# Altium schematic sheet Porsche Brake Light.SchDoc
size A4; SheetNumber: 1; SheetTotal: 1
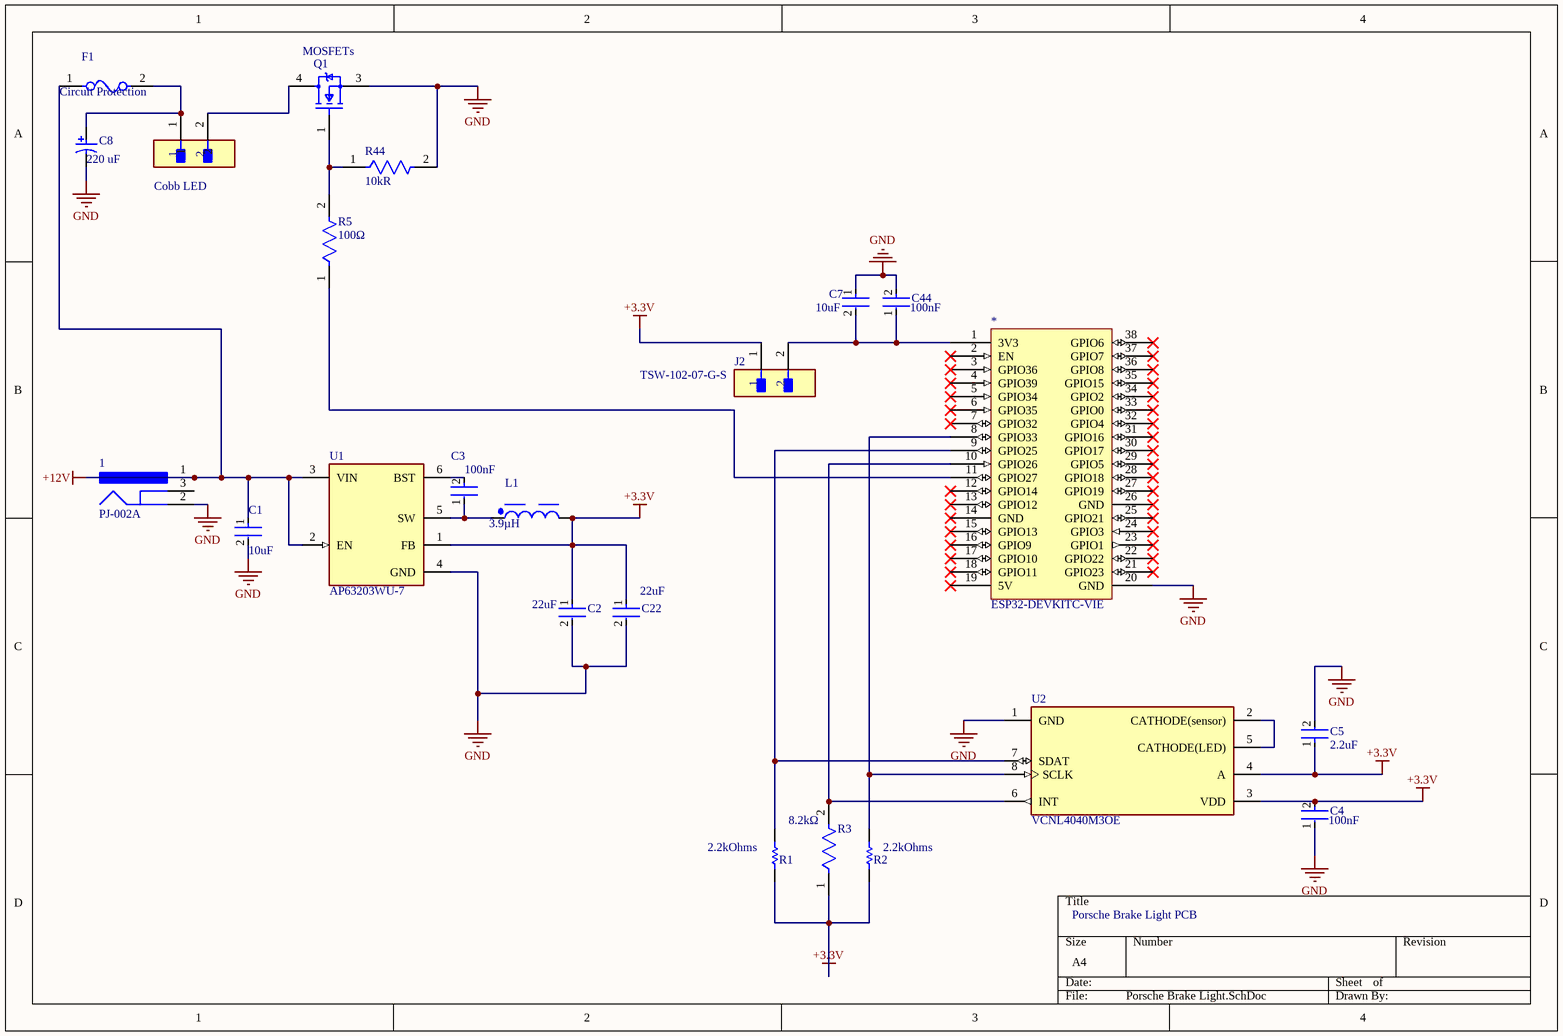
[diagram p0: Porsche Brake Light.SchDoc]

## Parts
1  PJ-002A  [CUI-PJ-002A_V]
*  ESP32-DEVKITC-VIE  [ESP32-DEVKITC-VIE-Footprint-1]
C1  Capacitance: 10uF  [FP-GRM21B-0_15-IPC_C]  (hidden comment: GRM21BR61E106KA73L)
C2  GRM21BZ71A226ME15L  [FP-GRM21B-0_2-e0_2_0_7-IPC_B]  (value not drawn)
C3  Capacitance: 100nF  [FP-C1608-080-0_1-IPC_B]  (hidden comment: C1608X7R1E104K080AA)
C4  Capacitance: 100nF  [FP-C1608-080-0_1-IPC_B]  (hidden comment: C1608X7R1E104K080AA)
C5  Capacitance: 2.2uF  [FP-GRM188-0_1-e0_2_0_5-MFG]  (hidden comment: GRM188R71A225KE15D)
C7  Capacitance: 10uF  [FP-GRM21B-0_15-IPC_C]  (hidden comment: GRM21BR61E106KA73L)
C8  EEE-FK1E221P  [PNSC-EEE-FK1E221P_N]  (value not drawn)
C22  GRM21BZ71A226ME15L  [FP-GRM21B-0_2-e0_2_0_7-IPC_B]  (value not drawn)
C44  Capacitance: 100nF  [FP-C1608-080-0_1-IPC_B]  (hidden comment: C1608X7R1E104K080AA)
Cobb_LED  TSW-102-14-G-S  [FP-TSW-102-14-G-S-MFG]  (value not drawn)
F1  Device Class L1: Circuit Protection  [FP-3216FF-MFG]  (hidden comment: TR/3216FF2-R)
J2  TSW-102-07-G-S  [FP-TSW-102-07-G-S-MFG]
L1  Inductance: 3.9µH  [WE-LQS_5020]  (hidden comment: 74404052039)
Q1  Device Class L3: MOSFETs  [FP-PG-TO252-3-MFG]  (hidden comment: IRLR7843TRPBF)
R1  Resistance: 2.2kOhms  [RESC1608X55X25LL10T15]  (hidden comment: RC0603FR-072K2L)
R2  Resistance: 2.2kOhms  [RESC1608X55X25LL10T15]  (hidden comment: RC0603FR-072K2L)
R3  Resistance: 8.2kΩ  [FP-RC0603-0_55-MFG]  (hidden comment: RC0603FR-078K2L)
R5  Resistance: 100Ω  [FP-RC0603-0_55-MFG]  (hidden comment: RC0603FR-07100RL)
R44  Resistance: 10kR  [FP-RC0603-0_55-IPC_C]  (hidden comment: RC0603FR-0710KL)
U1  AP63203WU-7  [FP-TSOT26-MFG]
U2  VCNL4040M3OE  [FP-VCNL4040M3OE-MFG]

## Nets
+3.3V: C2.1 C4.2 C5.1 C22.1 J2.1 L1.2 R1.1 R2.1 R3.1 U1.1(FB) U2.3(VDD) U2.4(A)
+12V: 1.1 C1.1 F1.1 U1.2(EN) U1.3(VIN)
GND: 1.2 *.20(GND) C1.2 C2.2 C4.1 C5.2 C7.1 C8.2 C22.2 C44.2 Q1.3(SOURCE) R44.2 U1.4(GND) U2.1(GND)
Net*_1: *.1(3V3) C7.2 C44.1 J2.2
Net*_8: *.8(GPIO33) R2.2 U2.8(SCLK)
Net*_9: *.9(GPIO25) R1.2 U2.7(SDAT)
Net*_10: *.10(GPIO26) R3.2 U2.6(INT)
Net*_11: *.11(GPIO27) R5.1
NetC3_1: C3.1 L1.1 U1.5(SW)
NetC3_2: C3.2 U1.6(BST)
NetC8_1: C8.1 Cobb_LED.1 F1.2
NetCobb_LED_2: Cobb_LED.2 Q1.4(DRAIN)
NetQ1_1: Q1.1(GATE) R5.2 R44.1
NetU2_2: U2.2(CATHODE(sensor)) U2.5(CATHODE(LED))

Not connected (* = marked no-connect by the designer): 1 3; * 2(EN)* 3(GPIO36)* 4(GPIO39)* 5(GPIO34)* 6(GPIO35)* 7(GPIO32)* 12(GPIO14)* 13(GPIO12)* 14(GND)* 15(GPIO13)* 16(GPIO9)* 17(GPIO10)* 18(GPIO11)* 19(5V)* 21(GPIO23)* 22(GPIO22)* 23(GPIO1)* 24(GPIO3)* 25(GPIO21)* 26(GND)* 27(GPIO19)* 28(GPIO18)* 29(GPIO5)* 30(GPIO17)* 31(GPIO16)* 32(GPIO4)* 33(GPIO0)* 34(GPIO2)* 35(GPIO15)* 36(GPIO8)* 37(GPIO7)* 38(GPIO6)*

## Notes on the sheet
- (near C8) 220 uF
- (near C2) 22uF
- (near C22) 22uF
- Porsche Brake Light PCB

## Library data of the parts
1 = CMP-2000-06895-2: Through Hole Right Angle DC Power Jack, 2.5 A, 2 mm Center Pin, 3 Position, -25 to 85 degC, RoHS, Bulk; Manufacturer: CUIInc.; Brand: CUI; Inside Contact Diameter: 2mm; Voltage Rating: 24V; Outside Contact Diameter: 6.5mm; Current Rating: 2.5A; Insulation Resistance: 50MOhms; Contact Gender: Male; Connector Type: DCPowerJack; Datasheet Version: Rev. 1.03, 04/2016; Housing Material: PolybutyleneTerephthalate(PBT); Operating Temperature Range: -25Cto+85C; Termination Style: ThroughHole; Product Category: DCPowerConnectors; Mounting Technology: ThroughHole; Mounting Style: ThroughHole; Factory Pack Quantity: 500; Contact Plating: Nickel; Package Reference: PJ-002A; Mounting Angle: Right; Package Description: 3-Pin Through Hole Device, Body 14.4 x 9 mm, Height 11 mm; Flammability Rating: UL94V-0; Manufacturer URL: http://www.cui.com/; Product: Jacks; Contact Material: Copper; Datasheet URL: http://www.cui.com/product/resource/pj-002a.pdf; RoHS: True
* = CMP-00025-00003-3: ESP32-WROVER-IE Series Evaluation Board 802.11 b/g/n (WiFi, WLAN) Bluetooth Smart Ready 4.x Dual Mode
C1 C7 = CMP-2007-03541-2: Chip Multilayer Ceramic Capacitors for General Purpose, 0805, 10uF, X5R, 15%, 10%, 25V; Length: 2mm; Depth: 1.25mm; Termination: SMD/SMT; Voltage: 25V; Height: 1.25mm; Material: Ceramic; Thickness: 0.053inch; Radiation Hardening: No; Min Operating Temperature: -55°C; Width: 0.049inch; Package Quantity: 1; Mount: Surface Mount; Dielectric: X5R; Packaging: Tape and Reel; Voltage Rating (DC): 25V; Lead Free: Lead Free; Max Operating Temperature: 85°C; Case Code (Imperial): 0805; Case/Package: 0805; Tolerance: 10%; Voltage Rating: 25V; Case Code (Metric): 2012
C2 C22 = CMP-06035-023072-1: Chip Multilayer Ceramic Capacitors for General Purpose, 0805, 22uF, X7R, 15%, 20%, 10V
C3 C4 C44 = CMP-2000-05395-2: Multilayer Ceramic Capacitors 100nF ±10% 25V X7R SMD 0603; Lead Free: Lead Free; REACH SVHC: No SVHC; Tolerance: 10%; Case Code (Metric): 1608; Packaging: Tape and Reel; Radiation Hardening: No; Dielectric: X7R; Height: 0.8mm; Width: 0.031inch; Voltage Rating (DC): 25V; Case Code (Imperial): 0603; Mount: Surface Mount; RoHS Compliant: Yes; Depth: 0.8mm; Min Operating Temperature: -55°C; Number of Pins: 2; Weight: 7.1E-05oz; Max Operating Temperature: 125°C; Dielectric Material: Ceramic; Resistor Type: Ceramic; Construction: Flat; Thickness: 0.037inch; Package Quantity: 1; Voltage Rating: 25V; Series: C; Voltage: 25V; Case/Package: 0603; Termination: SMD/SMT; Length: 1.6mm
C5 = CMP-2006-02836-2: Chip Multilayer Ceramic Capacitors for General Purpose, 0603, 2.2uF, X7R, 15%, 10%, 10V; Case Code (Metric): 1608; Height: 0.8mm; Packaging: Cut Tape; Voltage: 10V; Lead Free: Lead Free; Min Operating Temperature: -55°C; Voltage Rating (DC): 10V; Max Operating Temperature: 125°C; Voltage Rating: 10V; Dielectric: X7R; Depth: 0.8mm; Case Code (Imperial): 0603; Termination: SMD/SMT; Case/Package: 0603; Number of Pins: 2; REACH SVHC: No SVHC; Mount: Surface Mount; Width: 0.031inch; Material: Ceramic; Package Quantity: 1; Weight: 7.1E-05oz; Length: 1.6mm; Thickness: 0.035inch; Tolerance: 10%
C8 = CMP-1665-00017-3: Aluminum Electrolytic Capacitor, 220 uF, +/- 20%, 25 V, -55 to 105 degC, 2-Pin CAPAE, RoHS, Tape and Reel; Manufacturer: Panasonic; Voltage Rating: 25 V; ComponentLink2URL: http://industrial.panasonic.com/cdbs/www-data/pdf/RDE0000/ABA0000C1181.pdf; Height: 10.2 mm; Max Operating Temperature: 105 degC; PackageReference: EEE-FK1E221P; ComponentLink1Description: Manufacturer URL; ComponentLink1URL: http://www.panasonic.com/; Mount: Surface Mount; REACH SVHC: No SVHC; Min Operating Temperature: -55 degC; ComponentLink2Description: Datasheet; DatasheetVersion: 03/2016; Length: 10.2 mm; RoHSCompliant: true; Packaging: Tape and Reel; Package Quantity: 500; Lead Pitch: 3.1 mm; Pins: 2; PackageDescription: 2-Pin Electrolytic Aluminum Capacitor, Body 8.3 x 8.3 mm; Mounting Technology: Surface Mount
Cobb_LED = CMP-02766-001740-1: CONN HEADER VERT 2POS 2.54MM; Number of Positions: 2; Max Current Rating: 7.6A; Gender: Male; Max Voltage Rating (AC): 550V; Contact Mating Length: 0.32inch; REACH SVHC: No SVHC; Width: 2.54mm; Insulation Material: PBT; Contact Shape: Square; Contact Plating: Gold; Min Operating Temperature: -55°C; Contact Material: Bronze; Color: Black; Number of Contacts: 2; Housing Material: Polyester; Orientation: Straight; Flammability Rating: UL94 V-0; Max Operating Temperature: 125°C; Contact Type: Male Pin; Radiation Hardening: No; Termination: Solder; RoHS Compliant: Yes; Lead Free: Lead Free; Fastening Type: Pull; Pitch: 2.54mm; Number of Rows: 1; Series: TSW; Insulation Color: Black; Package Quantity: 1; Connector Type: Header; Length: 5.08mm; Contact Finish - Mating: GOLD; Mount: Through Hole; Housing Color: Black; Depth: 2.54mm; Packaging: Bulk
F1 = CMP-31519-000001-1: FUSE BRD MNT 2A 32VAC 63VDC 1206; Manufacturer: Cooper Bussmann; Automotive Grade: Grade 1; Max Fuse Dc Voltage: 63V; Max Fuse Ac Voltage: 32V; Value: 0.066Ω; Fuse Interrupt Dc Current: 50A; Fuse Blow Speed: Fast; Fuse I2T: 0.126A2Sec; Height: 1.09mm; Manufacturer Part Number: TR/3216FF2-R; Temperature Range High: +125°C; Package: 3216FF; Automotive: Yes; Mouser Description: Surface Mount Fuses 32VAC/DC 2A Fast Acting Chip Fuse; Device Class L3: unset; Lead Free: Yes; ComponentLink2URL: https://www.eaton.com/content/dam/eaton/products/electronic-components/resources/data-sheet/eaton-3216ff-surface-mount-fuse-data-sheet.pdf; Temperature Range Low: -55°C; Resistance: 0.066Ω; Device Class L2: Fuses; Temperature: -55°C to +125°C; Category: Fuse; Fuse Current: 2A; RoHS: TRUE; Octopart: https://octopart.com/tr%2F3216ff2-r-cooper+bussmann-8723903; Digikey Description: FUSE BRD MNT 2A 32VAC 63VDC 1206; Fuse Interrupt Ac Current: 50A; Ipc Land Pattern Name: CAPC320160X89; ComponentLink2Description: Datasheet
J2 = CMP-02766-000084-1: CONN HEADER VERT 2POS 2.54MM; Manufacturer: Samtec; Number Of Contacts: 2; Voltage Rating: 550V; Conn Orientation: Straight; Current Rating: 6.3A; Conn Gender: Male; Package: TSW-102-07-G-S; Digikey Description: CONN HEADER VERT 2POS 2.54MM; ComponentLink2URL: http://suddendocs.samtec.com/catalog_english/tsw_th.pdf; Height: 8.71mm; Temperature: -55°C to +125°C; Device Class L2: Headers and Wire Housings; ComponentLink2Description: Datasheet; Device Class L3: unset; Contact Material: Gold,Nickel; Temperature Range Low: -55°C; Temperature Range High: +125°C; RoHS: TRUE; Device Class L1: Connectors; Mouser Description: Conn Unshrouded Header HDR 2 POS 2.54mm Solder ST Thru-Hole Automotive Bulk; Number Of Rows: 1; Category: Conn; Pitch: 2.54mm; Lead Free: Yes; Automotive: No; Manufacturer Part Number: TSW-102-07-G-S; Footprint Url: http://suddendocs.samtec.com/prints/tsw-xxx-xx-x-x-xx-xxx-footprint.pdf; Octopart: https://octopart.com/tsw-102-07-g-s-samtec-272197
L1 = CMP-03913-61645215-2: Power Inductor, Aec-Q200, 3.9Uh, 2.4A Rohs Compliant: Yes; Self Resonant Frequency: 62MHz; Test Frequency: 100kHz; Shielding: Shielded; Tolerance: 30%; Saturation Current: 2.8A; DC Resistance (DCR): 50.5mΩ; Mount: Surface Mount; Case/Package: Nonstandard; Packaging: Tape & Reel (TR); Height: 2mm; Max Operating Temperature: 125°C; Length: 5mm; Ambient Temperature Range Low: -40°C; Height - Seated (Max): 2.0066mm; Current Rating: 2.4A; Composition: Wirewound; Width: 5mm; RoHS: Compliant; Min Operating Temperature: -40°C; Ambient Temperature Range High: 85°C
Q1 = CMP-32901-000143-1: MOSFET N-CH 30V 161A DPAK; Manufacturer: Infineon; Drain To Source Resistance: 3.2mΩ; Depletion Mode: False; Reverse Recovery Time: 39ns; Reverse Recovery Charge: 36nC; Threshold Vgs Max: 2.3V; Rthja Max: 50°C/W; Threshold Vgs Min: 1.4V; Power Dissipation: 140W; Pulse Drain Current: 620A; Input Capacitace At Vds: 4380pF @ 15V; Turn On Delay Time: 25ns; Gate To Source Voltage: 20V; Max Forward Diode Voltage: 1V; Gate Charge At Vgs: 34nC @ 4.5V; Max Junction Temp: +175°C; Number Of Channels: 1; Turn Off Delay Time: 34ns; ComponentLink2URL: https://www.infineon.com/dgdl/irlr7843pbf.pdf?fileId=5546d462533600a40153566de53526d8; Temperature Range High: +175°C; Octopart: https://octopart.com/irlr7843trpbf-infineon-65875062; Temperature: -55°C to +175°C; Manufacturer Part Number: IRLR7843TRPBF; Category: Trans; Package: PG-TO252-3; Footprint Url: https://www.infineon.com/cms/en/product/packages/PG-TO252/PG-TO252-3-901/; Continuous Drain Current: 161A; Digikey Description: MOSFET N-CH 30V 161A DPAK; Automotive: No; Lead Free: Yes; Drain To Source Breakdown Voltage: 30V; Height: 2.52mm; Temperature Range Low: -55°C; RoHS: TRUE; Number Of N Channels: 1; Drain To Source Voltage: 30V; ComponentLink2Description: Datasheet; Device Class L2: Transistors; Device Class L1: Discrete Semiconductors
R1 R2 = CMP-2000-06934-1: Thick Film Resistor, 2.2 KOhm, 100 mW, 50 V, +/- 1%, -55 to 155 degC, 2-Pin SMD (0603), RoHS, Tape and Reel; Manufacturer: Yageo; Temperature Coefficient: 100PPM/C; Voltage Rating: 50V; Power Rating: 100mW; Tolerance: 1%; Datasheet Version: Rev. 7, 05/2017; Case Code - mm: 1608; Series: RC; Mounting Technology: SurfaceMount; Package Description: 2-Pin Surface Mount Device, Body 1.6 x 0.8 mm; Case Code - in: 0603; Package Reference: 0603; Product: ThickFilmResistorsGeneralPurpose; Manufacturer URL: http://www.yageo.com/; Termination Style: SMD/SMT; Operating Temperature Range: -55Cto+155C; Datasheet URL: http://www.yageo.com/documents/recent/PYu-RC_Group_51_RoHS_L_7.pdf; Packaging: Reel
R3 = CMP-1659-00040-2: NexarPartId: 40301092; Voltage Rating (AC): 50V; Power Rating: 100mW; Temperature Coefficient: 100ppm/°C; Tolerance: 1%; Number of Terminations: 2; Length: 1.6mm; Height: 450µm; Composition: Thick Film; Case Code (Imperial): 0603; Features: Moisture Resistant; Width: 800µm; Max Operating Temperature: 155°C; Lead Pitch: 300µm; Voltage Rating: 50V; Termination: SMD/SMT; Case Code (Metric): 1608; Max Power Dissipation: 100mW; REACH SVHC: No SVHC; Number of Pins: 2; Min Operating Temperature: -55°C; Case/Package: 0603; Packaging: Tape & Reel; Voltage Rating (DC): 50V; Schedule B: 8533210045, 8533210045; Lead Free: Lead Free; RoHS: Compliant; Military Standard: Not; Depth: 800µm
R5 = CMP-2100-03663-2: NexarPartId: 55402879; Voltage Rating: 50V; Power Rating: 100mW; Tolerance: 1%; Temperature Coefficient: 100ppm/°C; Case/Package: 0603; Military Standard: Not; REACH SVHC: Unknown; Case Code (Metric): 0603; Max Operating Temperature: 155°C; Schedule B: 8533210045, 8533210045; Height: 450µm; Length: 1.6mm; Lead Free: Lead Free; Packaging: Tape & Reel; Case Code (Imperial): 0603; Composition: Thick Film; Min Operating Temperature: -55°C; Voltage Rating (DC): 50V; RoHS: Compliant; Depth: 800µm; Number of Pins: 2; Termination: SMD/SMT; Width: 800µm
R44 = CMP-2100-03664-2: RES 10K OHM 1% 1/10W 0603; Voltage Rating: 75V; Voltage Rating (DC): 50V; Power Rating: 100mW; Temperature Coefficient: 100ppm/°C; Depth: 0.8mm; Termination: SMD/SMT; Resistor Type: Thick Film; Series: RC; Construction: Rectangular; Features: Moisture Resistant; Packaging: Tape and Reel; Min Operating Temperature: -55°C; Number of Terminations: 2; Lead Pitch: 0.3mm; RoHS Compliant: Yes; Case/Package: 0603; Resistance Tolerance: 1%; Military Standard: Not; Weight: 7.1E-05oz; Number of Pins: 2; Tolerance: 1%; Length: 1.6mm; Case Code (Imperial): 0603; Lead Free: Lead Free; Width: 0.8mm; Max Power Dissipation: 100mW; Height: 0.45mm; Max Operating Temperature: 155°C; Case Code (Metric): 1608; Size Code: 0603
U1 = CMP-12757-000006-1: IC REG BUCK 3.3V 2A TSOT26; Manufacturer: Diodes Inc.; Output Type: Fixed; Min Supply Voltage: 3.8V; Number Of Outputs: 1; Max Junction Temp: +160°C; Nominal Supply Current: 22uA; Standoff Height: 0.01mm; Switching Frequency: 1.1MHz; Max Supply Voltage: 32V; ComponentLink2Description: Datasheet; Device Class L1: Integrated Circuits (ICs); Temperature: to +160°C; Device Class L3: Voltage Regulators - Switching; RoHS: TRUE; Octopart: https://octopart.com/ap63203wu-7-diodes+inc.-98099550; Output Voltage: 3.3V; Lead Free: Yes; ComponentLink2URL: https://www.diodes.com/assets/Datasheets/AP63200-AP63201-AP63203-AP63205.pdf; Digikey Description: IC REG BUCK 3.3V 2A TSOT26; Footprint Url: https://www.diodes.com/assets/Package-Files/TSOT26.pdf; Ambient Temperature Range High: +85°C; Height: 1mm; Automotive: No; Temperature Range High: +160°C; Switching Topology: Buck; Output Current: 2A; Package: TSOT26; Category: IC; Mouser Description: AP63203 Series 3.3 V 2 A SMT Fixed Low IQ Synchronous Buck - TSOT-26; Device Class L2: Power Management ICs; Ambient Temperature Range Low: -40°C; Manufacturer Part Number: AP63203WU-7
U2 = CMP-02530-000002-1: SENSOR OPT 550NM AMBIENT 8SMD; Manufacturer: Vishay; Sensor Output: I2C; Max Supply Voltage: 3.6V; Min Supply Voltage: 2.5V; Operating Supply Current: 0.2-300uA; ComponentLink2Description: Datasheet; Temperature: -40°C to +85°C; Device Class L2: Optical Sensors; Digikey Description: SENSOR OPT 550NM AMBIENT 8SMD; Package: 0; ComponentLink2URL: https://www.vishay.com/docs/84274/vcnl4040.pdf; Device Class L3: unset; Temperature Range High: +85°C; Height: 1.15mm; Ambient Temperature Range High: +85°C; Lead Free: Yes; Ambient Temperature Range Low: -40°C; Automotive: No; RoHS: TRUE; Category: IC; Device Class L1: Sensors; Temperature Range Low: -40°C; Octopart: https://octopart.com/vcnl4040m3oe-vishay-56243155; Manufacturer Part Number: VCNL4040M3OE